# EAGLE design SNIPE (EAGLE 6.4)
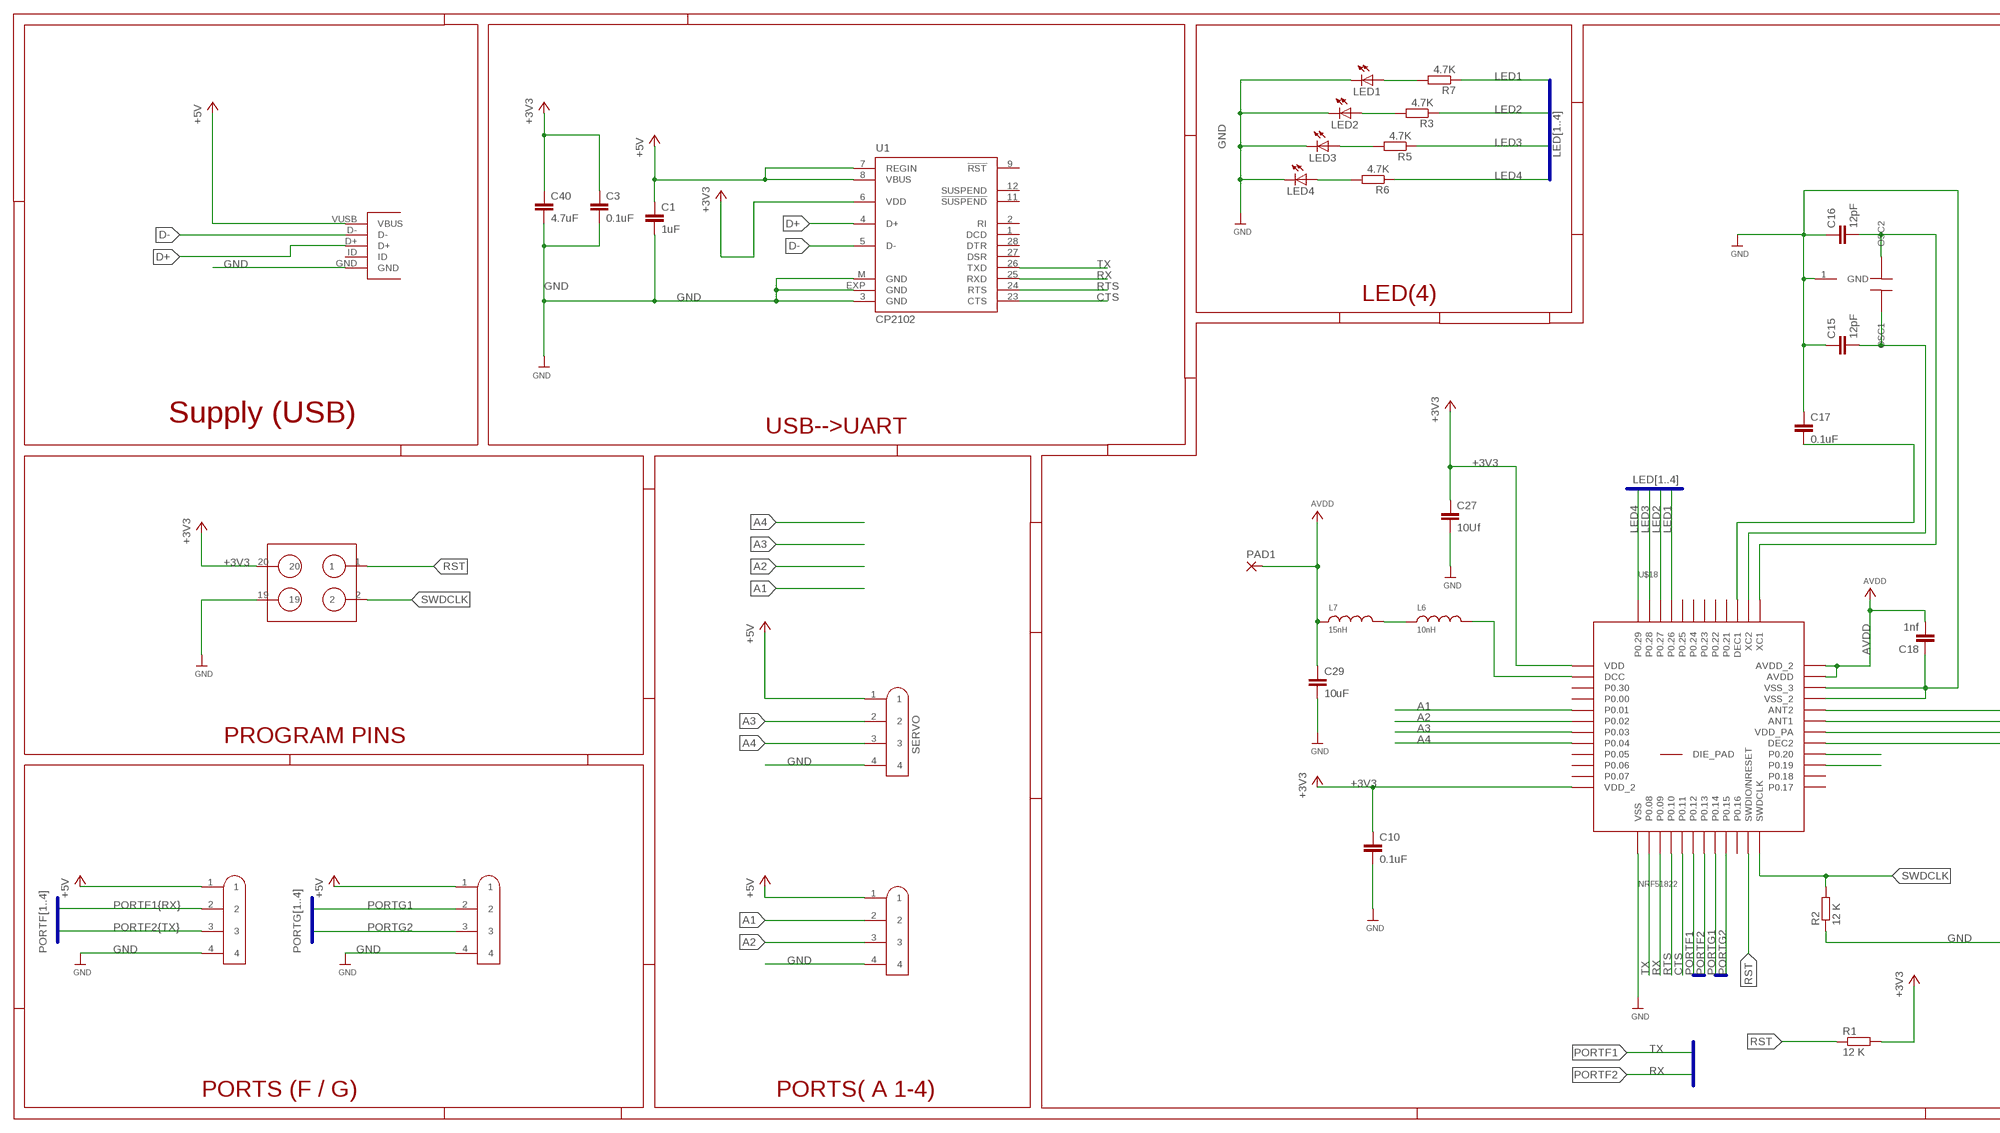
[diagram p0: schematic, sheet 1, part 1 of 2]
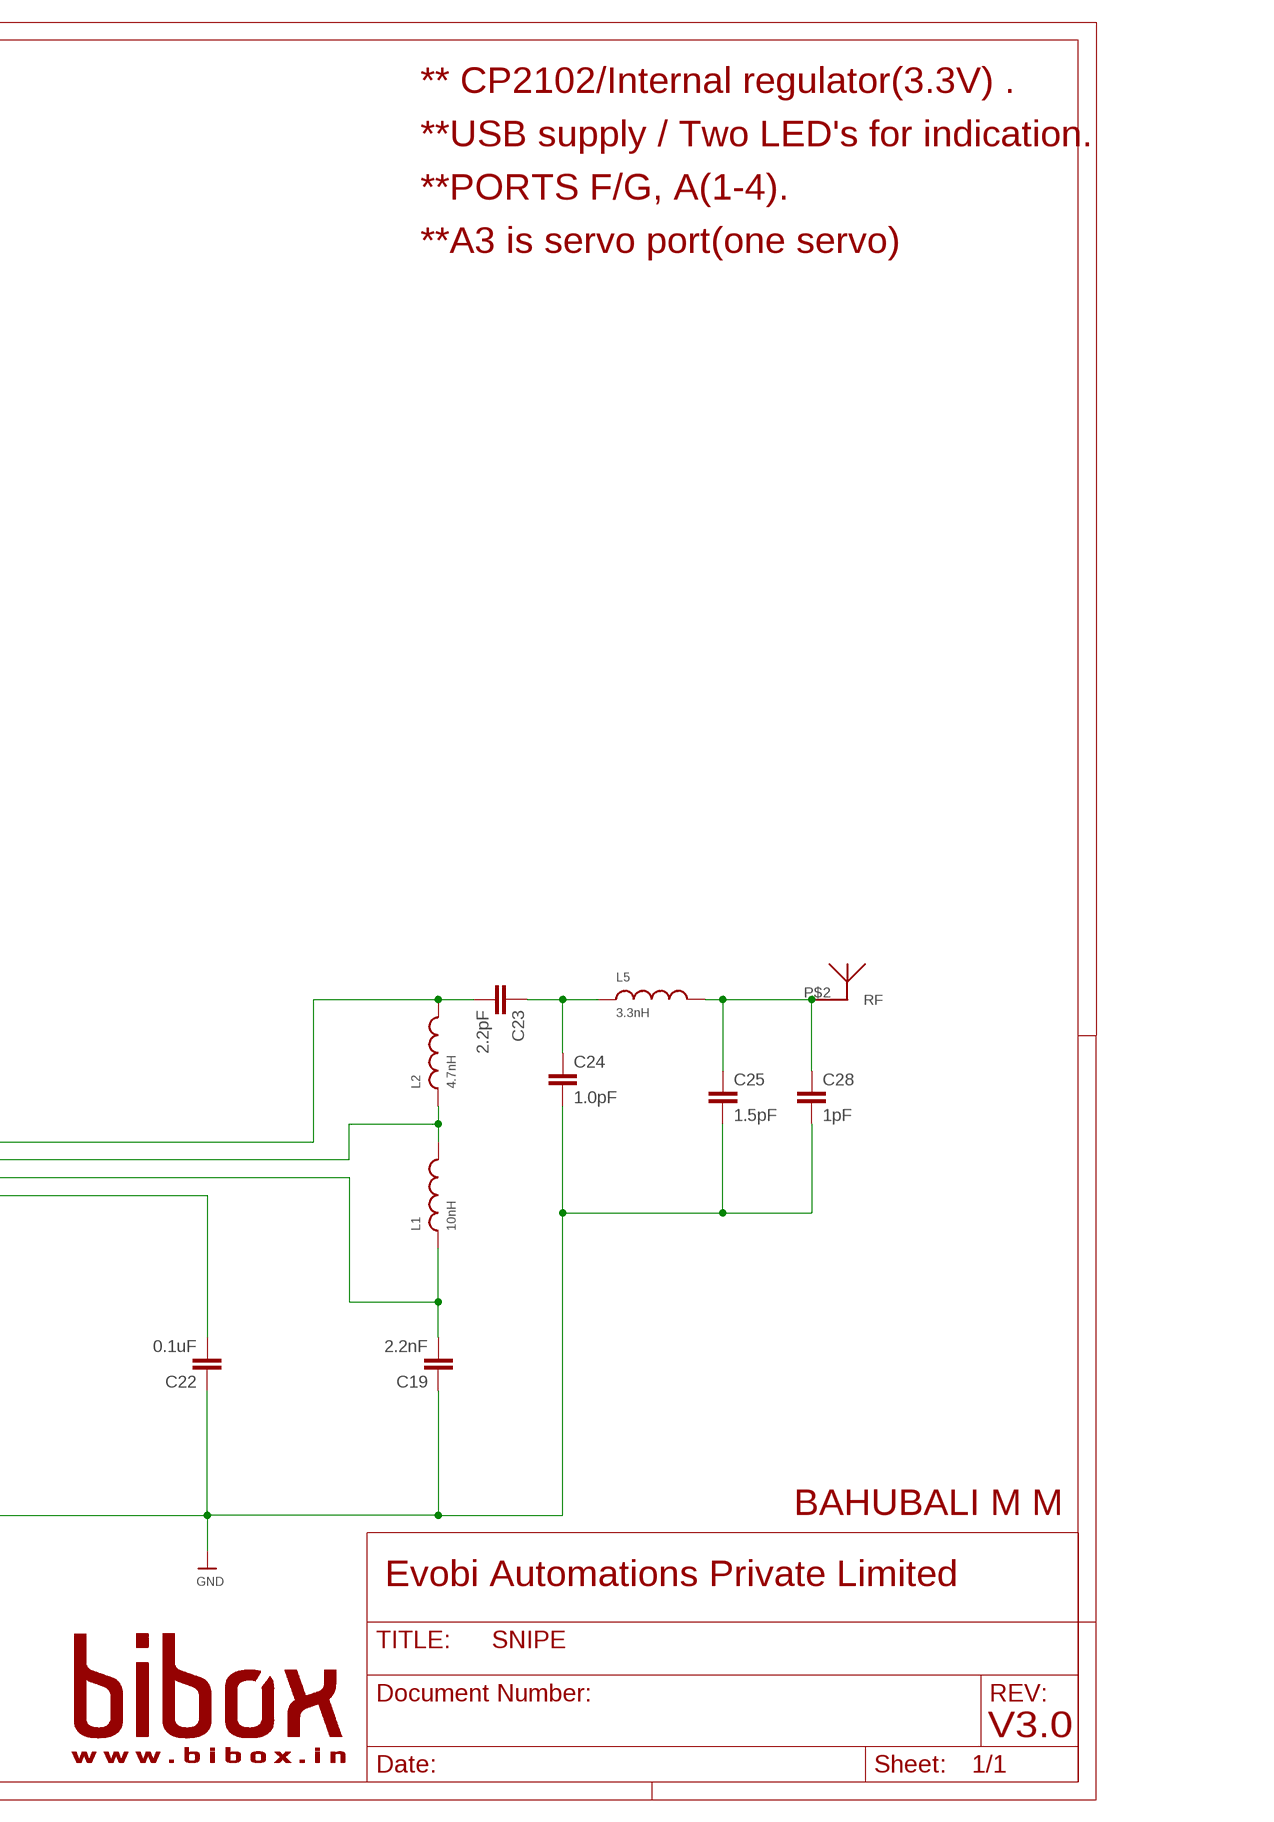
[diagram p1: schematic, sheet 1, part 2 of 2]

## Parts
C1  1uF  CAP0603  [0603]
C3  0.1uF  C-EUC0603  [C0603]
C10  0.1uF  C-EUC0603  [C0603]
C15  12pF  C-EUC0603  [C0603]
C16  12pF  C-EUC0603  [C0603]
C17  0.1uF  C-EUC0603  [C0603]
C18  1nf  C-EUC0603  [C0603]
C19  2.2nF  C-EUC0603  [C0603]
C22  0.1uF  C-EUC0603  [C0603]
C23  2.2pF  C-EUC0603  [C0603]
C24  1.0pF  C-EUC0603  [C0603]
C25  1.5pF  C-EUC0603  [C0603]
C27  10Uf  C-EUC0603  [C0603]
C28  1pF  C-EUC0603  [C0603]
C29  10uF  C-EUC0603  [C0603]
C40  4.7uF  C-EUC0603  [C0603]
L1  10nH  INDUCTOR0603  [0603]
L2  4.7nH  INDUCTOR0603  [0603]
L5  3.3nH  INDUCTOR0603  [0603]
L6  10nH  INDUCTOR0603  [0603]
L7  15nH  INDUCTOR0603  [0603]
LED1  LEDCHIP-LED0805  [CHIP-LED0805]
LED2  LEDCHIP-LED0805  [CHIP-LED0805]
LED3  LEDCHIP-LED0805  [CHIP-LED0805]
LED4  LEDCHIP-LED0805  [CHIP-LED0805]
PAD1  SMD2  [SMD1,27-2,54]
R1  12 K  R-EU_R0603  [R0603]
R2  12 K  R-EU_R0603  [R0603]
R3  4.7K  R-EU_R0603  [R0603]
R5  4.7K  R-EU_R0603  [R0603]
R6  4.7K  R-EU_R0603  [R0603]
R7  4.7K  R-EU_R0603  [R0603]
U1  CP2102  CP210X_USB_UART  [MLP28]
U$1  USBMICRO  [USBMICRO]
U$2  3.5MM-JACK  [3.5MM-JACK]
U$4  CRYSTAL8MHZ  [8MHZ]
U$5  3.5MM-JACK  [3.5MM-JACK]
U$6  10X2  [10X2]
U$18  NRF51822  [QFN48]
U$19  3.5MM-JACK  [3.5MM-JACK]
U$20  3.5MM-JACK  [3.5MM-JACK]
U$40  WTBT  [BTWT]

## Nets
+3V3: C3.1 C10.1 C27.1 C40.1 R1.2 U1.6(VDD) U$6.20 U$18.1(VDD) U$18.12(VDD_2)
+5V: C1.1 U1.7(REGIN) U1.8(VBUS) U$1.VUSB(VBUS) U$2.1 U$5.1 U$19.1 U$20.1
A1: U$2.2 U$18.5(P0.01)
A2: U$2.3 U$18.6(P0.02)
A3: U$5.2 U$18.7(P0.03)
A4: U$5.3 U$18.8(P0.04)
AVDD: C18.2 C29.1 L7.1 PAD1.1(P) U$18.35(AVDD) U$18.36(AVDD_2)
CTS: U1.23(CTS) U$18.17(P0.11)
D+: U1.4(D+) U$1.D+
D-: U1.5(D-) U$1.D-
LED1: R7.1 U$18.45(P0.26)
LED2: R3.1 U$18.46(P0.27)
LED3: R5.1 U$18.47(P0.28)
LED4: R6.1 U$18.48(P0.29)
N$1: U$18.28(P0.20)
N$2: U$18.27(P0.19)
N$3: LED1.A R7.2
N$4: LED2.A R3.2
N$5: LED3.A R5.2
N$6: LED4.A R6.2
N$8: C17.2 U$18.39(DEC1)
N$14: C16.2 U$4.OSC2 U$18.37(XC1)
N$17: C23.2 L2.2 U$18.32(ANT2)
N$18: L1.2 L2.1 U$18.31(ANT1)
N$20: C23.1 C24.1 L5.1
N$21: C25.1 C28.1 L5.2 U$40.P$2(RF)
N$23: C19.2 L1.1 U$18.30(VDD_PA)
N$24: C15.2 U$4.OSC1 U$18.38(XC2)
N$25: C22.2 U$18.29(DEC2)
N$26: L6.2 U$18.2(DCC)
N$27: L6.1 L7.2
N$38: C1.2 C3.2 C10.2 C15.1 C16.1 C17.1 C18.1 C19.1 C22.1 C24.2 C25.2 C27.2 C28.2 C29.2 C40.2 LED1.C LED2.C LED3.C LED4.C R2.1 U1.3(GND) U1.EXP(GND) U1.M(GND) U$1.GND U$2.4 U$4.1(GND) U$5.4 U$6.19 U$18.13(VSS) U$18.33(VSS_2) U$18.34(VSS_3) U$19.4 U$20.4 ; supply symbol labelled GND
PORTF1: U$18.18(P0.12) U$20.2
PORTF2: U$18.19(P0.13) U$20.3
PORTG1: U$18.20(P0.14) U$19.2
PORTG2: U$18.21(P0.15) U$19.3
RST: R1.1 U$6.1 U$18.23(SWDIO/NRESET)
RTS: U1.24(RTS) U$18.16(P0.10)
RX: U1.25(RXD) U$18.15(P0.09)
SWDCLK: R2.2 U$6.2 U$18.24(SWDCLK)
TX: U1.26(TXD) U$18.14(P0.08)
Unconnected: U1.1(DCD) U1.2(RI) U1.9(!RST) U1.11(!SUSPEND) U1.12(SUSPEND) U1.27(DSR) U1.28(DTR) U$1.ID U$18.3(P0.30) U$18.4(P0.00) U$18.9(P0.05) U$18.10(P0.06) U$18.11(P0.07) U$18.22(P0.16) U$18.25(P0.17) U$18.26(P0.18) U$18.40(P0.21) U$18.41(P0.22) U$18.42(P0.23) U$18.43(P0.24) U$18.44(P0.25) U$18.GND(DIE_PAD)

## Buses
PORTG[1..4]
PORTF[1..4]
LED[1..4]

## Notes on the sheet
- ** CP2102/Internal regulator(3.3V) .
- **USB supply / Two LED's for indication.
- GND | **PORTS F/G, A(1-4).
- **A3 is servo port(one servo)
- GND
- GND
- GND | LED(4)
- Supply (USB)
- USB-->UART
- PROGRAM PINS
- SERVO
- GND
- {RX}
- {TX}
- GND | BAHUBALI M M
- GND | GND
- GND
- Evobi Automations Private Limited
- TX
- RX
- V3.0
- PORTS (F / G) | PORTS( A 1-4)

## Library data of the parts
C1 = SparkFun:CAP: Capacitor Standard 0603 ceramic capacitor, and 0.1" leaded capacitor.
C3 C10 C15-C19 C22-C25 C27-C29 C40 = rcl:C-EU: CAPACITOR, European symbol
L1 L2 L5-L7 = new:INDUCTOR: Inductors 0603: 10nH Ceramic Inductor - microwire antenna/RF (Digikey: 712-1434-2-ND) 0805: 560nH Ceramic Inductor - RF (Digikey: 553-1047-1-ND) 1007 (2518 Metric) SMT: 10µH 10% 250mOhm 820mA 1007 Inductor (Digikey: 587-2189-1-ND) 22µH 10% 500mOhm 580mA 1007 Inductor (Digikey: 587-2190-1-ND) 47µH 10% 950mOhm 420mA 1007 Inductor (Digikey: 587-2191-1-ND) 47µH 5% 100mOhm 1A 1008 Inductor (Digikey: 732-1816-1-ND) 6.0x6.0mm: 4.7µH 20% 3.8A 27mOhm Inductor (Digikey: 445-6538-2-ND)
LED1-LED4 = led:LED: LED OSRAM: - CHIPLED LG R971, LG N971, LY N971, LG Q971, LY Q971, LO R971, LY R971 LH N974, LH R974 LS Q976, LO Q976, LY Q976 LO Q996 - Hyper CHIPLED LW Q18S LB Q993, LB Q99A, LB R99A - SideLED LS A670, LO A670, LY A670, LG A670, LP A670 LB A673, LV A673, LT A673, LW A673 LH A674 LY A675 LS A676, LA A676, LO A676, LY A676, LW A676 LS A679, LY A679, LG A679 - Hyper Micro SIDELED® LS Y876, LA Y876, LO Y876, LY Y876 LT Y87S - SmartLED LW L88C, LW L88S LB L89C, LB L89S, LG L890 LS L89K, LO L89K, LY L89K LS L896, LA L896, LO L896, LY L896 - TOPLED LS T670, LO T670, LY T670, LG T670, LP T670 LSG T670, LSP T670, LSY T670, LOP T670, LYG T670 LG T671, LOG T671, LSG T671 LB T673, LV T673, LT T673, LW T673 LH T674 LS T676, LA T676, LO T676, LY T676, LB T676, LH T676, LSB T676, LW T676 LB T67C, LV T67C, LT T67C, LS T67K, LO T67K, LY T67K, LW E67C LS E67B, LA E67B, LO E67B, LY E67B, LB E67C, LV E67C, LT E67C LW T67C LS T679, LY T679, LG T679 LS T770, LO T770, LY T770, LG T770, LP T770 LB T773, LV T773, LT T773, LW T773 LH T774 LS E675, LA E675, LY E675, LS T675 LS T776, LA T776, LO T776, LY T776, LB T776 LHGB T686 LT T68C, LB T68C - Hyper Mini TOPLED® LB M676 - Mini TOPLED Santana® LG M470 LS M47K, LO M47K, LY M47K Source: http://www.osram.convergy.de LUXEON: - LUMILED® LXK2-PW12-R00, LXK2-PW12-S00, LXK2-PW14-U00, LXK2-PW14-V00 LXK2-PM12-R00, LXK2-PM12-S00, LXK2-PM14-U00 LXK2-PE12-Q00, LXK2-PE12-R00, LXK2-PE12-S00, LXK2-PE14-T00, LXK2-PE14-U00 LXK2-PB12-K00, LXK2-PB12-L00, LXK2-PB12-M00, LXK2-PB14-N00, LXK2-PB14-P00, LXK2-PB14-Q00 LXK2-PR12-L00, LXK2-PR12-M00, LXK2-PR14-Q00, LXK2-PR14-R00 LXK2-PD12-Q00, LXK2-PD12-R00, LXK2-PD12-S00 LXK2-PH12-R00, LXK2-PH12-S00 LXK2-PL12-P00, LXK2-PL12-Q00, LXK2-PL12-R00 Source: www.luxeon.com KINGBRIGHT: KA-3528ASYC Source: www.kingbright.com
PAD1 = wirepad:SMD2: SMD PAD
R1-R3 R5-R7 = rcl:R-EU_: RESISTOR, European symbol
U1 = SparkFun:CP210X_USB_UART: Single-Chip USB to UART Bridge Source: www.silabs.com .. CP2101.pdf / cp2102.pdf. Spark Fun Electronics SKU : COM-00310
U$1 = USB micro female - through hole:USBMICRO
U$2 U$5 U$19 U$20 = 3.5mm jack(4 pole):3.5MM-JACK
U$4 = CRYSTAL16 Mhz:CRYSTAL8MHZ
U$6 = NANO BERGSTRIP 2x2:10X2
U$18 = NordicSemi:NRF51822: Bluetooth 4.0 Low Energy/2.4Ghz NORDIC SEMICONDUCTOR
U$40 = NRF WT-BT-ATENNA -1:WTBT

## Board
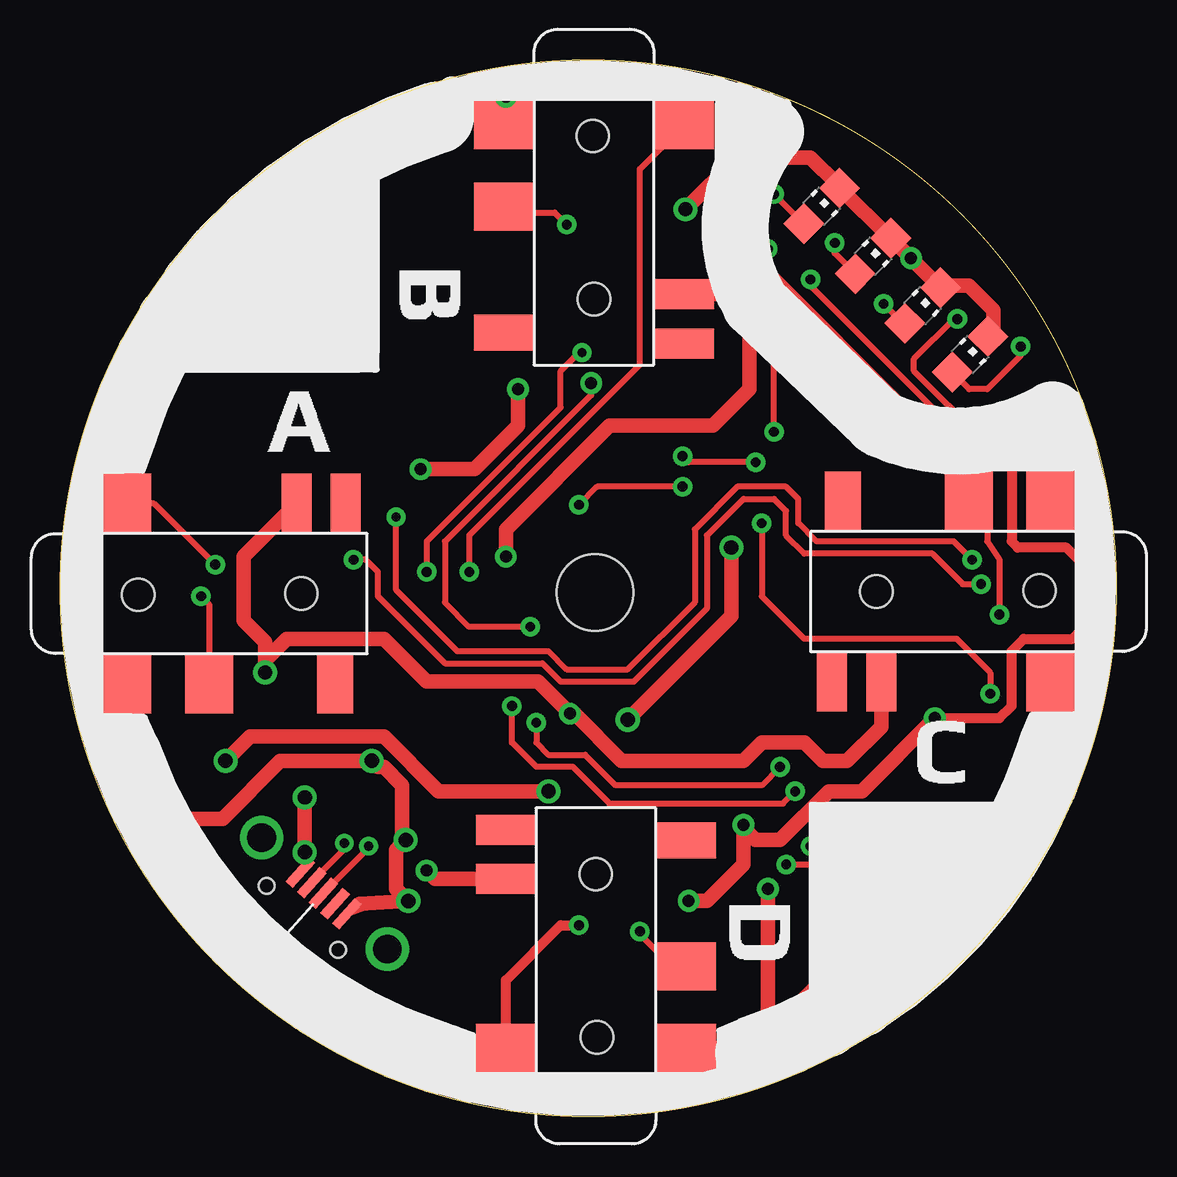
[diagram p2: board, top side]
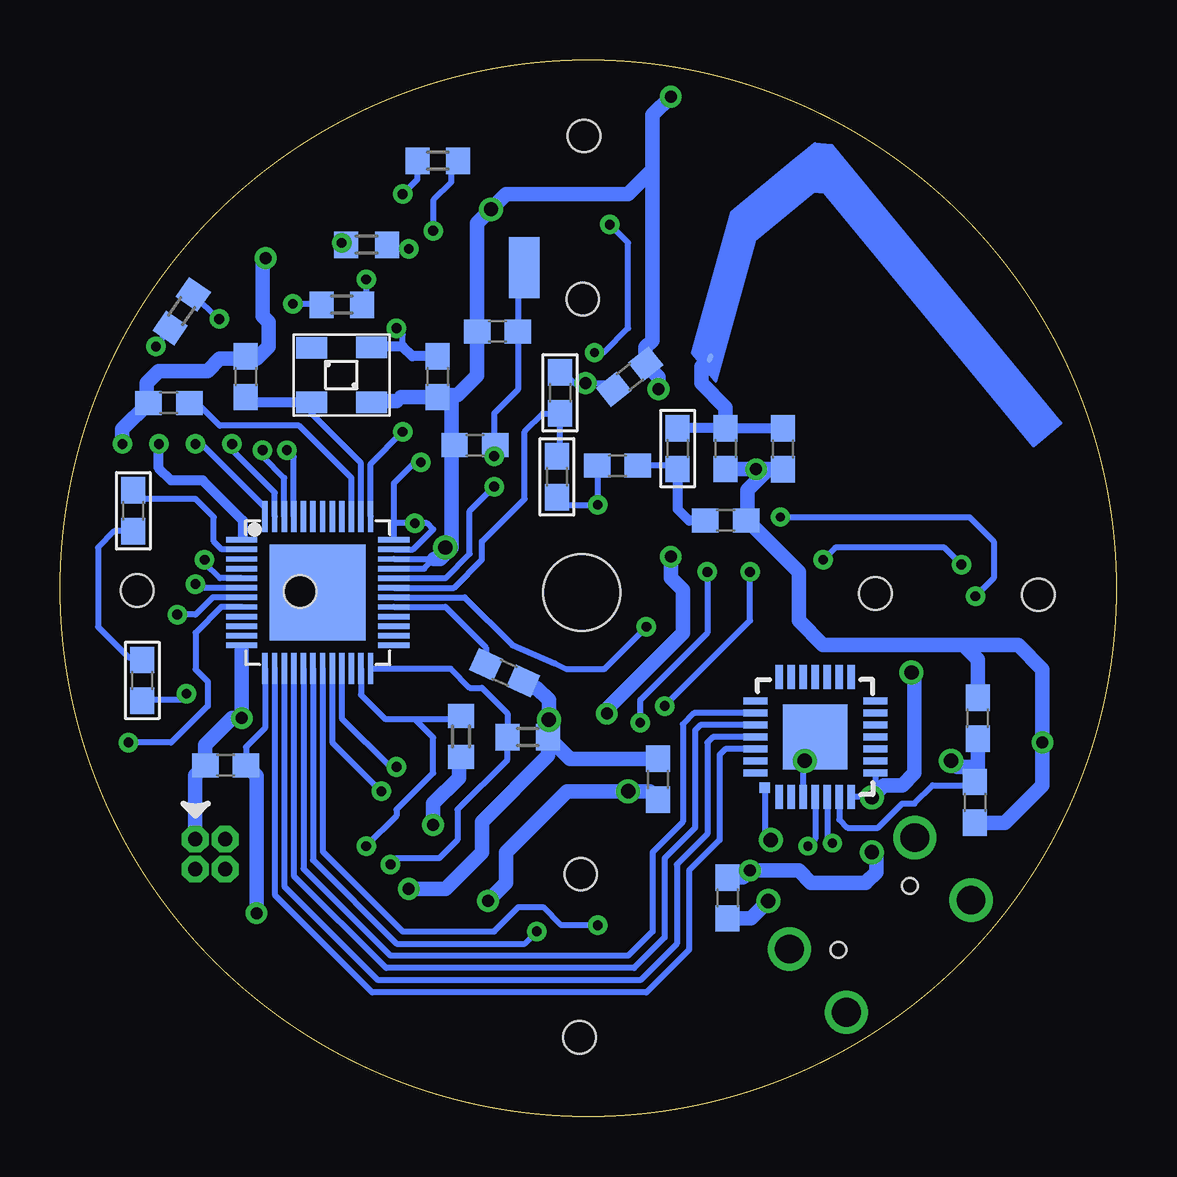
[diagram p3: board, bottom side, seen from below]

Size 44.05 x 44.05 mm. Coordinates in mm from the lower left corner, seen from the top.
Outline: circle at 22.02,22.02 radius 22.02
Copper layers (1*16): Top 0.035mm / dielectric 1.5mm / Bottom 0.035mm
Design rules "default *": minimum track width 10mil, minimum drill 24mil, track to track 8mil, track to pad 8mil, pad to pad 8mil, via to via 8mil, smd to smd 8mil, copper to edge 40mil, drill to drill 8mil, minimum pad ring 10mil, minimum via ring 8mil, stop-mask expansion 4mil, vias tented up to drill 30mil, thermal gap 10mil
Holes 3.2 mm at 22.3,21.84

### Footprints (pad centres in the part's own frame; a part is rotated, then mirrored left to right if it is on the bottom)
0603 = smd 1.1 x 1: 1 -0.85,0; 2 0.85,0
C0603 = smd 1.1 x 1: 1 -0.85,0; 2 0.85,0
CHIP-LED0805 = smd 1.2 x 1.2: A 0,-1.05; C 0,1.05
SMD1,27-2,54 = smd 1.27 x 2.54: 1 0,0
R0603 = smd 1 x 1.1: 1 -0.85,0; 2 0.85,0
MLP28 = smd 1 x 0.3: 1 -2.5,1.5; 2 -2.5,1; 3 -2.5,0.5; 4 -2.5,0; 5 -2.5,-0.5; 6 -2.5,-1; 7 -2.5,-1.5; 15 2.5,-1.5; 16 2.5,-1; 17 2.5,-0.5; 18 2.5,0; 19 2.5,0.5; 20 2.5,1; 21 2.5,1.5 | smd 0.3 x 1: 8 -1.5,-2.5; 9 -1,-2.5; 10 -0.5,-2.5; 11 0,-2.5; 12 0.5,-2.5; 13 1,-2.5; 14 1.5,-2.5; 22 1.5,2.5; 23 1,2.5; 24 0.5,2.5; 25 0,2.5; 26 -0.5,2.5; 27 -1,2.5; 28 -1.5,2.5 | smd 2.7 x 2.7: EXP 0,0 | smd 0.435 x 0.435: M -2.103,2.103
USBMICRO = smd 0.4 x 1.4: D+ 0.04,-3.66; D- 0.69,-3.66; GND -1.26,-3.66; ID -0.61,-3.66; VUSB 1.34,-3.66 | drill 1.2: P$1 3.5,-3.65; P$7 3.5,-0.15; P$9 -3.5,-3.7; P$10 -3.5,-0.15 | hole 0.65: 2,-2.3; -2,-2.3
3.5MM-JACK = smd 1.25 x 2.5: 1 4.065,3.71; NOC 6.115,3.71 | smd 2 x 2.5: 2 0.415,-3.79; 3 -2.985,3.71; 4 -2.985,-3.79 | smd 1.5 x 2.5: NC 5.665,-3.79 | hole 1.35: -2.535,-0.09; 4.265,-0.04
8MHZ = smd 1.3 x 0.9: 1 -1.235,1.075; 2 1.255,-1.205; OSC1 1.265,1.075; OSC2 -1.235,-1.215
10X2 = drill 0.6 pad 0.8 octagon: 1 -0.64,0.57; 2 -0.64,-0.68; 19 0.61,-0.68; 20 0.61,0.57
QFN48 = smd 1.3 x 0.226: 1 -3.17,2.2; 2 -3.17,1.8; 3 -3.17,1.4; 4 -3.17,1; 5 -3.17,0.6; 6 -3.17,0.2; 7 -3.17,-0.2; 8 -3.17,-0.6; 9 -3.17,-1; 10 -3.17,-1.4; 11 -3.17,-1.8; 12 -3.17,-2.2; 25 3.17,-2.2; 26 3.17,-1.8; 27 3.17,-1.4; 28 3.17,-1; 29 3.17,-0.6; 30 3.17,-0.2; 31 3.17,0.2; 32 3.17,0.6; 33 3.17,1; 34 3.17,1.4; 35 3.17,1.8; 36 3.17,2.2 | smd 0.226 x 1.3: 13 -2.2,-3.17; 14 -1.8,-3.17; 15 -1.4,-3.17; 16 -1,-3.17; 17 -0.6,-3.17; 18 -0.2,-3.17; 19 0.2,-3.17; 20 0.6,-3.17; 21 1,-3.17; 22 1.4,-3.17; 23 1.8,-3.17; 24 2.2,-3.17; 37 2.2,3.17; 38 1.8,3.17; 39 1.4,3.17; 40 1,3.17; 41 0.6,3.17; 42 0.2,3.17; 43 -0.2,3.17; 44 -0.6,3.17; 45 -1,3.17; 46 -1.4,3.17; 47 -1.8,3.17; 48 -2.2,3.17 | smd 4 x 4: GND 0,0
BTWT = smd 0.406 x 0.203 rotated 304.9: P$2 2.61,-0.06

### Placement (x,y rotation side)
C1  16.22,9.12 270 bottom
C3  5.91,13.1 270 bottom
C10  37.14,14.64 0 bottom
C15  36.3,30.84 270 bottom
C16  28.3,30.84 90 bottom
C17  39.51,29.74 0 bottom
C18  25.81,32.72 0 bottom
C19  20.3,30.84 218.5 bottom
C22  25.51,18.5 156 bottom
C23  20.8,27.13 180 bottom
C24  16.3,24.84 0 bottom
C25  13.92,27.83 270 bottom
C27  19.11,14.06 90 bottom
C28  16.3,27.84 270 bottom
C29  26.75,27.99 180 bottom
C40  5.79,16.61 90 bottom
L1  23.2,30.17 270 bottom
L2  23.33,26.67 270 bottom
L5  18.3,27.84 90 bottom
L6  40.99,25.25 90 bottom
L7  40.61,18.18 90 bottom
LED1  31.75,37.97 315 top
LED2  33.89,35.88 315 top
LED3  35.97,33.81 315 top
LED4  37.94,31.78 315 top
PAD1  24.68,35.39 180 bottom
R1  27.33,15.84 270 bottom
R2  24.54,15.82 180 bottom
R3  31.26,36.34 180 bottom
R5  32.3,33.84 180 bottom
R6  38.97,33.57 235.4 bottom
R7  28.3,39.84 180 bottom
U1  12.56,15.82 90 bottom
U$1  8.57,6.57 138 top
U$2  5.8,21.84 0 top
U$4  32.3,30.84 180 bottom
U$5  38.3,21.84 180 top
U$6  37.8,10.99 0 top
U$18  33.3,21.84 0 bottom
U$19  22.3,38.34 270 top
U$20  22.3,5.84 90 top
U$40  18.56,33.68 309.5 bottom

### Tracks (layer width: path | path; a pad name or v marks a point on that pad's centre or on a via)
+3V3  (via drill 0.41, 0.5, 0.6)
  Top 0.406: v39.92,28.04 39.67,27.78 39.67,23.97 39.92,23.72 41.95,23.72 42.71,22.96 42.71,20.42 42.21,19.91 40.17,19.91 39.67,19.4 39.67,17.12 39.16,16.61 v36.47,16.61
  Top 0.61: v36.47,16.61 33.42,13.56 32.05,13.56 30.01,11.53 29,11.53 28.49,12.04 v28.49,12.16 28.49,10.51 26.97,8.99 v26.2,8.99 | v6.9,14.83 7.92,15.85 13.5,15.85 15.79,13.56 v20.36,13.56
  Bottom 0.203: 36.49,19.62 U$18.12
  Bottom 0.254: U1.6 11.56,12.38 11.22,12.04 9.95,12.04 8.93,13.05 8.42,13.05 7.66,13.81 6.05,13.81 C3.1 6.28,14.32 | 36.49,19.62 36.49,19.47 36.47,19.44 | 36.43,24.16 36.43,24.08 arc90 U$18.1
  Bottom 0.406: v39.92,28.04 39.92,27.02 39.41,26.51 38.09,26.51 36.43,24.85 36.43,24.16
  Bottom 0.61: R1.2 27.42,15.08 27.42,14.12 28.49,13.05 v28.49,12.16 | 5.88,15.85 C40.1 5.79,14.58 | 5.79,14.58 5.79,14.08 C3.1 | v6.9,14.83 6.65,14.58 5.79,14.58 | v26.2,8.99 25.44,9.75 25.44,11.02 22.9,13.56 v20.36,13.56 19.46,13.56 C27.1 | U$6.20 38.41,14.22 C10.1 37.99,15.49 36.87,16.61 v36.47,16.61 36.47,19.44
+5V  (via drill 0.5, 0.6)
  Top 0.254: U$1.VUSB 10.2,10.37 10.2,10.77
  Top 0.61: U$19.1 28.09,34.28 28.74,33.63 28.74,30.32 27.22,28.8 22.9,28.8 18.58,24.48 v18.58,23.34 | U$5.1 34.23,16.25 32.81,14.83 31.79,14.83 31.03,15.59 29.25,15.59 28.49,14.83 23.41,14.83 21.44,16.8 v21.25,16.8 19.92,18.13 15.28,18.13 13.5,19.91 9.44,19.91 8.55,19.02 | U$2.1 7.66,23.36 7.66,20.67 8.55,19.78 8.55,19.02 | 10.2,10.77 v10.2,11.02 v10.2,13.31 | U$20.1 15.63,9.91 v15.28,10.26 | 8.55,19.02 v8.55,18.51
  Bottom 0.254: U1.7 10.22,13.32 v10.2,13.31 10.06,13.44 U1.8
  Bottom 0.61: v18.58,23.34 18.58,22.45 18.08,21.94 18.08,20.16 21.25,16.99 v21.25,16.8 | v10.2,11.02 10.02,10.84 U$1.VUSB 10.46,9.75 12.74,9.75 13.25,10.26 v15.28,10.26 15.58,9.97 C1.1 | v10.2,13.31 9.69,13.81 8.93,13.81 8.42,14.32 8.42,18.39 v8.55,18.51
A1  (via drill 0.38, 0.41)
  Top 0.254: 6.39,18.13 6.14,17.88 6.14,17.98 U$2.2 6.21,21.36 v5.88,21.69 | v38.02,23.21 37.25,23.97 31.54,23.97 30.78,24.74 30.78,25.75 30.27,26.26 28.24,26.26 26.46,24.48 26.46,21.43 23.66,18.64 21.12,18.64 20.36,19.4 16.55,19.4 14.01,21.94 v14.01,24.99
  Bottom 0.254: U$18.5 37.37,22.44 38.02,23.09 v38.02,23.21 | v14.01,24.99 6.14,24.99 5.12,23.97 5.12,22.45 v5.88,21.69
A2  (via drill 0.41)
  Top 0.254: v38.4,22.2 37.63,22.2 36.36,23.47 31.03,23.47 30.27,24.23 30.27,25.24 29.76,25.75 28.49,25.75 26.97,24.23 26.97,21.18 23.92,18.13 20.87,18.13 20.11,18.89 16.04,18.89 13.25,21.69 13.25,22.7 12.74,23.21 v12.23,23.21 | v6.47,23.01 3.92,25.55 U$2.3
  Bottom 0.254: U$18.6 38.24,22.04 v38.4,22.2 | v12.23,23.21 11.73,23.72 7.18,23.72 v6.47,23.01
A3  (via drill 0.41)
  Top 0.254: U$5.2 38.02,25.5 38.65,25.5 38.65,23.97 39.16,23.21 v39.16,20.93
  Bottom 0.254: U$18.7 37.68,21.64 38.4,20.93 v39.16,20.93
A4  (via drill 0.41)
  Top 0.254: v41.19,15.59 41.19,18.04 U$5.3
  Top 0.305: 40.77,17.62 U$5.3
  Bottom 0.254: U$18.8 37.32,21.24 38.4,20.16 38.4,18.64 37.89,18.13 37.89,17.12 39.41,15.59 v41.19,15.59
AVDD  (via drill 0.41)
  Top 0.254: v29,27.28 26.2,27.28 v25.95,27.53 | v29.25,24.74 29.25,21.69 31.03,19.91 37.38,19.91 38.78,18.51 v38.78,17.62
  Bottom 0.254: C18.2 24.84,32.61 | C18.2 24.96,30.3 25.95,29.31 25.95,28.04 C29.1 25.9,27.58 v25.95,27.53 | U$18.36 30.13,24.74 | 30.13,24.74 30.13,26.4 29.25,27.28 v29,27.28 | L7.1 40.58,17.37 39.03,17.37 v38.78,17.62 | 30.13,24.74 v29.25,24.74 28.74,24.74 28.49,24.48 29.33,23.64 U$18.35 | PAD1.1 24.96,35.11 C18.2
CTS
  Bottom 0.254: U$18.17 33.9,10.33 30.27,6.7 20.36,6.7 19.35,7.72 19.35,11.02 18.08,12.29 18.08,16.35 17.61,16.82 U1.23
D+  (via drill 0.38)
  Top 0.254: U$1.D+ 12.74,11.08 v12.87,11.27
  Bottom 0.254: U1.4 12.56,11.58 v12.87,11.27
D-  (via drill 0.38)
  Top 0.254: U$1.D- 10.5,9.8 11.85,11.15 v11.85,11.4
  Bottom 0.254: U1.5 12.06,11.61 v11.85,11.4
LED1  (via drill 0.41)
  Top 0.254: v28.49,36.93 28.49,35.66 34.59,29.56 v34.59,27.78
  Bottom 0.254: U$18.45 34.3,27.49 v34.59,27.78 | R7.1 27.73,39.56 27.73,38.96 28.46,38.23 28.46,36.96 v28.49,36.93
LED2  (via drill 0.41)
  Top 0.254: v29.51,36.17 29.51,35.4 35.6,29.31 v35.6,27.78
  Bottom 0.254: U$18.46 34.7,26.62 35.6,27.53 v35.6,27.78 | v29.51,36.17 30.24,36.17 R3.1
LED3  (via drill 0.41)
  Top 0.254: v31.28,34.9 31.28,34.64 36.87,29.05 v36.87,28.04
  Bottom 0.254: U$18.47 35.1,26.01 36.87,27.78 v36.87,28.04 | v31.28,34.9 31.28,34.01 R5.1
LED4  (via drill 0.41)
  Top 0.254: v38.4,28.04 38.4,28.29 35.6,31.09 35.6,31.59 37.25,33.25 v37.41,33.25
  Bottom 0.254: U$18.48 35.5,25.39 38.14,28.04 v38.4,28.04 | v37.41,33.25 R6.1
N$3  (via drill 0.41)
  Top 0.254: LED1.A 30.86,37.36 v29.76,38.45
  Bottom 0.254: v29.76,38.45 29.15,39.07 R7.2
N$4  (via drill 0.41)
  Top 0.254: LED2.A 32.55,35.74 32.3,35.99 v32.3,36.42
  Bottom 0.254: R3.2 32.3,36.53 v32.3,36.42
N$5  (via drill 0.41)
  Top 0.254: LED3.A 34.79,33.42 v34.33,33.88
  Bottom 0.254: v34.33,33.88 33.18,33.88 R5.2
N$6  (via drill 0.41)
  Top 0.254: 37.1,31.11 LED4.A 37.91,30.32 38.65,30.32 40.05,31.72 v40.05,32.1
  Bottom 0.254: v40.05,32.1 R6.2
N$8
  Bottom 0.254: U$18.39 31.9,26.62 34.08,28.8 37.38,28.8 38.32,29.74 C17.2
N$14  (via drill 0.41)
  Top 0.254: v29.76,28.55 29.76,32.61 v30.01,32.86
  Bottom 0.254: U$18.37 31.1,27.21 v29.76,28.55 | 29.76,32.1 29.76,32.61 v30.01,32.86
  Bottom 0.406: C16.2 29.35,31.69 29.76,32.1 31.02,32.1 U$4.OSC2
N$17  (via drill 0.41)
  Top 0.254: v25.95,26.26 22.39,26.26 v21.63,25.5
  Bottom 0.254: U$18.32 27.98,22.45 26.97,23.47 26.97,25.24 v25.95,26.26 | L2.2 23.01,25.5 v21.63,25.5 21.63,27.11 C23.2
N$18
  Bottom 0.254: U$18.31 27.63,22.04 26.46,23.21 26.46,23.97 24.68,25.75 24.68,28.55 23.92,29.31 23.21,29.31 L1.2 | 23.2,29.01 L1.2 | L2.1 23.2,27.65 L1.2
N$20
  Bottom 0.254: L5.1 18.43,27.13 C23.1
  Bottom 0.406: C24.1 17.82,24.84 18.3,25.32 L5.1
N$21
  Bottom 0.406: C25.1 C28.1 L5.2
  Bottom 0.61: C28.1 16.3,29.56 17.31,30.58 17.31,31.26 U$40.P$2
N$23  (via drill 0.41, 0.5)
  Top 0.254: v19.6,20.42 17.06,20.42 16.04,21.43 16.04,23.97 22.14,30.07 v22.14,30.58
  Bottom 0.254: U$18.30 27.18,21.64 25.19,19.66 23.41,18.89 22.9,18.64 21.38,18.64 v19.6,20.42 | L1.1 23.13,31.09 22.62,30.58 v22.14,30.58 20.96,30.58 C19.2
N$24
  Bottom 0.254: U$18.38 31.5,27.23 33.56,29.3 U$4.OSC1
  Bottom 0.406: U$4.OSC1 36.07,29.77 C15.2
N$25
  Bottom 0.254: U$18.29 27.98,21.24 26.29,19.55 C22.2
N$26
  Bottom 0.254: L6.2 40.63,25.75 38.4,25.75 37.63,24.99 37.63,23.97 37.3,23.64 U$18.2
N$27
  Bottom 0.254: L6.1 41.78,24.4 42.46,23.72 42.46,20.42 41.19,19.15 40.73,19.15 L7.2
N$38  (via drill 0.41, 0.5, 0.58, 0.6)
  Top 0.254: U$1.GND 12.74,8.73 12.49,8.86
  Top 0.61: v18.58,42.52 18.51,42.44 U$19.4 | U$2.4 2.81,15.87 v3.09,15.59 3.09,13.81 4.49,12.42 6.77,12.42 9.19,14.83 v13,14.83 13.25,14.58 13.5,14.58 14.27,13.81 14.27,11.68 v14.41,11.53 | 29.51,3.4 34.59,8.48 v35.86,8.48 37.13,8.48 38.16,9.51 U$6.19 | 12.49,8.86 v14.52,8.99 14.01,9.5 14.01,11.13 v14.41,11.53 | 14.52,11.42 v14.41,11.53 | 26.09,3.01 U$20.4 28.97,2.86 29.51,3.4 | v27.98,23.72 27.98,20.86 v23.66,16.55 | 38.42,32.59 LED4.C 38.9,32.75 38.9,33.63 37.89,34.64 36.62,34.64 LED3.C v35.48,35.79 LED2.C LED1.C 32.42,38.84 31.28,39.98 28.24,39.98 v26.08,37.82 | U$5.4 41.44,25.8 v41.44,28.04 | v19.09,30.32 19.09,28.8 17.28,26.98 v15.03,26.98 | v29.51,9.5 29.51,3.4
  Bottom 0.254: U$18.34 28.46,23.24 28.86,22.84 U$18.33 | U$18.13 35.5,16.2 36.29,15.41 C10.2 | 13.06,15.32 U1.EXP | 14.39,11.4 14.52,11.53 14.67,11.68 v14.41,11.53 14.67,11.78 U1.M | 28.2,23.24 28.2,23.5 v27.98,23.72 | U1.3 13.06,14.76 v13,14.83
  Bottom 0.406: C28.2 | 30.84,29.99 U$4.1
  Bottom 0.61: 14.52,26.98 C25.2 13.76,26.83 | C28.2 v15.03,26.98 14.52,26.98 | 27.73,30.07 27.47,30.07 26.66,30.89 C18.1 26.66,37.24 v26.08,37.82 25.44,38.45 20.36,38.45 19.35,39.47 | 27.73,30.07 28.22,30.07 C16.1 29.84,29.99 30.01,29.82 31.01,29.82 U$4.1 | 28.46,23.24 28.2,23.24 27.73,23.72 27.73,28.29 | 27.73,28.29 27.73,30.07 | C29.2 27.6,28.16 27.73,28.29 | 24.66,17.99 C22.1 24.45,17.88 24.17,17.88 23.66,17.37 v23.66,16.55 23.69,16.52 R2.1 | C3.2 4.65,12.25 3.09,13.81 v3.09,15.59 3.09,18.64 4.11,19.66 6.39,19.66 | v14.52,8.99 15.24,8.27 C1.2 | R2.1 23.69,15.05 26.46,12.29 26.46,11.02 27.98,9.5 v29.51,9.5 | v14.41,11.53 14.27,11.38 14.52,11.53 | v13,14.83 13,15.39 U1.EXP | v41.44,28.04 41.44,28.65 C17.1 40.43,29.82 40.43,30.57 39.92,31.09 37.89,31.09 37.38,31.59 36.4,31.59 | 19.35,39.47 19.35,32.36 19.63,32.07 C19.1 19.09,30.83 v19.09,30.32 | 19.35,39.47 19.35,41.75 v18.58,42.52 | 14.52,26.98 15.39,26.11 15.39,24.9 C24.2 15.39,24.84 13.25,22.7 13.25,20.67 12.23,19.66 6.39,19.66 | C10.2 35.86,14.21 v35.86,8.48 | C40.2 5.79,19.05 6.39,19.66 | 36.4,31.59 C15.1 | 36.4,31.59 35.86,31.59 35.35,32.1 35.35,33.12 35.6,33.37 35.6,35.66 v35.48,35.79 | C27.2 22.78,14.91 R2.1
PORTF1  (via drill 0.41)
  Top 0.254: 26.41,5.94 U$20.2 26.65,6.26 26.71,6.19 25.44,6.19 25.51,6.26 24.17,7.59 v24.17,7.72
  Bottom 0.254: U$18.18 33.5,10.69 30.01,7.21 24.68,7.21 v24.17,7.72
PORTF2  (via drill 0.41)
  Top 0.254: 18.33,3.12 U$20.3
  Top 0.406: U$20.3 18.59,5.69 20.87,7.97 v21.63,7.97
  Bottom 0.254: U$18.19 33.1,11.05 29.76,7.72 25.95,7.72 24.93,8.73 23.92,8.73 23.16,7.97 v21.63,7.97
PORTG1  (via drill 0.38, 0.41)
  Top 0.254: 19.62,37.93 U$19.2 18.84,37.6 18.84,37.44 19.09,37.69 20.62,37.69 v21.12,37.18 | v18.84,17.12 18.84,15.59 19.85,14.58 21.38,14.58 22.9,13.05 30.14,13.05 v30.65,13.56 | v21.76,31.85 21.63,31.85 20.87,31.09 20.87,29.56 15.28,23.97 v15.28,22.7
  Bottom 0.254: U$18.20 32.7,15.61 v30.65,13.56 | v18.84,17.12 15.28,20.67 v15.28,22.7 | v21.76,31.85 21.38,31.85 20.36,32.86 20.36,36.42 v21.12,37.18
PORTG2  (via drill 0.41)
  Top 0.254: U$19.3 24.17,39.5 24.17,31.34 17.06,24.23 v17.06,22.7 | v19.85,16.42 19.85,15.59 20.36,15.08 21.89,15.08 23.16,13.81 29.25,13.81 v30.01,14.58
  Bottom 0.254: v17.06,22.7 17.06,20.16 19.85,17.37 v19.85,16.42 | U$18.21 32.3,16.6 30.27,14.58 v30.01,14.58
RST  (via drill 0.41)
  Top 0.254: v31.28,11.27 36.87,11.27 U$6.1
  Bottom 0.254: U$18.23 31.5,17.58 30.47,16.56 29.25,16.56 | 27.22,16.8 R1.1 27.47,16.56 29.25,16.56 | 29.25,16.56 28.49,15.8 28.49,14.32 30.01,12.8 30.01,12.54 v31.28,11.27
RTS
  Bottom 0.254: U$18.16 34.3,10.04 30.45,6.19 20.11,6.19 18.84,7.46 18.84,10.77 17.57,12.04 17.57,16.1 17.35,16.32 U1.24
RX
  Bottom 0.254: U$18.15 34.7,9.61 30.78,5.69 19.85,5.69 18.33,7.21 18.33,10.51 17.06,11.78 17.06,15.59 16.83,15.82 U1.25
SWDCLK  (via drill 0.41)
  Top 0.254: v30.27,10.51 34.59,10.51 35.09,10 36.85,10 U$6.2
  Bottom 0.254: U$18.24 27.76,18.67 26.97,17.88 26.46,17.88 25.39,16.81 R2.2 25.39,14.88 27.47,12.8 27.47,11.53 28.24,10.77 30.01,10.77 v30.27,10.51
TX
  Bottom 0.254: U$18.14 35.1,9.24 31.03,5.18 19.6,5.18 17.82,6.96 17.82,10.26 16.55,11.53 16.55,15.08 16.32,15.32 U1.26